# EAGLE design IR-BlueDM-MLX90620 Kit (EAGLE 6.2)
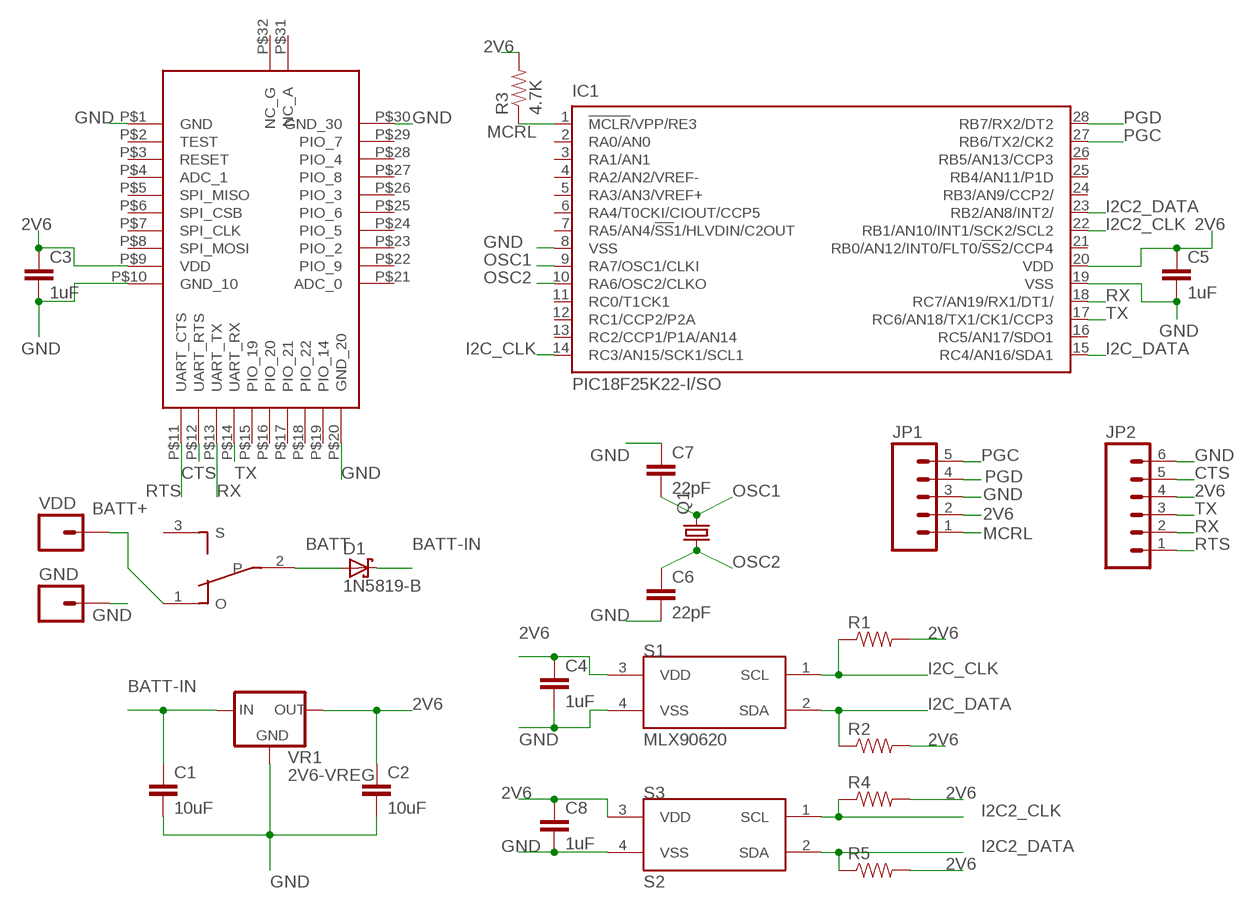
[diagram p0: schematic, sheet 1]

## Parts
C1  10uF  CAPPTH1  [CAP-PTH-5MM]
C2  10uF  CAPPTH1  [CAP-PTH-5MM]
C3  1uF  CAPPTH1  [CAP-PTH-5MM]
C4  1uF  CAPPTH1  [CAP-PTH-5MM]
C5  1uF  CAPPTH1  [CAP-PTH-5MM]
C6  22pF  CAPPTH1  [CAP-PTH-5MM]
C7  22pF  CAPPTH1  [CAP-PTH-5MM]
C8  1uF  CAPPTH1  [CAP-PTH-5MM]
D1  1N5819-B  [DO41-7.6]
GND  M01PTH  [1X01]
IC1  PIC18F25K22-I/SO  [SO28W]
IC2  BR-LE4.0-D2A  [BR-LE4.0-X2A]
JP1  M05PTH  [1X05]
JP2  M06SIP  [1X06]
Q1  CRYSTALHC49S  [HC49/S]
R1  RESISTORPTH-1/4W  [AXIAL-0.4]
R2  RESISTORPTH-1/4W  [AXIAL-0.4]
R3  4.7K  RESISTORPTH-1/4W  [AXIAL-0.4]
R4  RESISTORPTH-1/4W  [AXIAL-0.4]
R5  RESISTORPTH-1/4W  [AXIAL-0.4]
S1  MLX90620  [TO-39]
S2  SMALL_SWITCH  [EG1213]
S3  S2  MLX90620  [TO-39]
VDD  M01PTH  [1X01]
VR1  2V6-VREG  [TO-92]

## Nets
2V6: C2.1 C3.1 C4.1 C5.1 C8.1 IC1.20(VDD) IC2.P$9(VDD) JP1.2 JP2.4 R1.P$2 R2.P$2 R3.P$2 R4.P$2 R5.P$2 S1.3(VDD) S3.3(VDD) VR1.1(OUT)
BATT: D1.A S2.2(P)
BATT+: S2.1(O) VDD.1
BATT-IN: C1.1 D1.C VR1.3(IN)
CTS: IC2.P$12(UART_RTS) JP2.5
GND [Small 8mil]: C1.2 C2.2 C3.2 C4.2 C5.2 C6.2 C7.1 C8.2 GND.1 IC1.8(VSS) IC1.19(VSS) IC2.P$1(GND) IC2.P$10(GND_10) IC2.P$20(GND_20) IC2.P$30(GND_30) JP1.3 JP2.6 S1.4(VSS) S3.4(VSS) VR1.2(GND)
I2C2_CLK: IC1.22(RB1/AN10/INT1/SCK2/SCL2) R4.P$1 S3.1(SCL)
I2C2_DATA: IC1.23(RB2/AN8/INT2/) R5.P$1 S3.2(SDA)
I2C_CLK [Small 8mil]: IC1.14(RC3/AN15/SCK1/SCL1) R1.P$1 S1.1(SCL)
I2C_DATA: IC1.15(RC4/AN16/SDA1) R2.P$1 S1.2(SDA)
MCRL: IC1.1(!MCLR!/VPP/RE3) JP1.1 R3.P$1
OSC1 [Medium 10mil]: C7.2 IC1.9(RA7/OSC1/CLKI) Q1.2
OSC2 [Medium 10mil]: C6.1 IC1.10(RA6/OSC2/CLKO) Q1.1
PGC: IC1.27(RB6/TX2/CK2) JP1.5
PGD: IC1.28(RB7/RX2/DT2) JP1.4
RTS: IC2.P$11(UART_CTS) JP2.1
RX: IC1.18(RC7/AN19/RX1/DT1/) IC2.P$13(UART_TX) JP2.2
TX: IC1.17(RC6/AN18/TX1/CK1/CCP3) IC2.P$14(UART_RX) JP2.3
Unconnected: IC1.2(RA0/AN0) IC1.3(RA1/AN1) IC1.4(RA2/AN2/VREF-) IC1.5(RA3/AN3/VREF+) IC1.6(RA4/T0CKI/CIOUT/CCP5) IC1.7(RA5/AN4/!SS!1/HLVDIN/C2OUT) IC1.11(RC0/T1CK1) IC1.12(RC1/CCP2/P2A) IC1.13(RC2/CCP1/P1A/AN14) IC1.16(RC5/AN17/SDO1) IC1.21(RB0/AN12/INT0/FLT0/!SS!2/CCP4) IC1.24(RB3/AN9/CCP2/) IC1.25(RB4/AN11/P1D) IC1.26(RB5/AN13/CCP3) IC2.P$2(TEST) IC2.P$3(RESET) IC2.P$4(ADC_1) IC2.P$5(SPI_MISO) IC2.P$6(SPI_CSB) IC2.P$7(SPI_CLK) IC2.P$8(SPI_MOSI) IC2.P$15(PIO_19) IC2.P$16(PIO_20) IC2.P$17(PIO_21) IC2.P$18(PIO_22) IC2.P$19(PIO_14) IC2.P$21(ADC_0) IC2.P$22(PIO_9) IC2.P$23(PIO_2) IC2.P$24(PIO_5) IC2.P$25(PIO_6) IC2.P$26(PIO_3) IC2.P$27(PIO_8) IC2.P$28(PIO_4) IC2.P$29(PIO_7) IC2.P$31(NC_A) IC2.P$32(NC_G) S2.3(S)

## Library data of the parts
C1-C8 = SparkFun-Boards:CAP: Capacitor Standard 0603 ceramic capacitor, and 0.1" leaded capacitor.
D1 = diode:1N581*: 1.0A SCHOTTKY BARRIER RECTIFIER Source: http://www.diodes.com/datasheets/ds23001.pdf
GND VDD = SparkFun-Connectors:M01: Header 1 Standard 1-pin 0.1" header. Use with straight break away headers (SKU : PRT-00116), right angle break away headers (PRT-00553), swiss pins (PRT-00743), machine pins (PRT-00117), and female headers (PRT-00115).
IC1 = pic18f25k22:PIC18F25K22: PIC18F25K22 28 pin DIP
IC2 = BlueRadios_D2_S2_C46_Eagle_footprint:BR-LE4.0-D2A
JP1 = SparkFun-Connectors:M05: Header 5 Standard 5-pin 0.1" header. Use with straight break away headers (SKU : PRT-00116), right angle break away headers (PRT-00553), swiss pins (PRT-00743), machine pins (PRT-00117), and female headers (PRT-00115). Molex polarized connector foot print use with SKU : PRT-08230 with associated crimp pins and housings.
JP2 = SparkFun-Connectors:M06: Header 6 Standard 6-pin 0.1" header. Use with straight break away headers (SKU : PRT-00116), right angle break away headers (PRT-00553), swiss pins (PRT-00743), machine pins (PRT-00117), and female headers (PRT-00115). Molex polarized connector foot print use with SKU : PRT-08094 with associated crimp pins and housings. NOTES ON THE VARIANTS LOCK and LOCK_LONGPADS... This footprint was designed to help hold the alignment of a through-hole component (i.e. 6-pin header) while soldering it into place. You may notice that each hole has been shifted either up or down by 0.005 of an inch from it's more standard position (which is a perfectly straight line). This slight alteration caused the pins (the squares in the middle) to touch the edges of the holes. Because they are alternating, it causes a "brace" to hold the component in place. 0.005 has proven to be the perfect amount of "off-center" position when using our standard breakaway headers. Although looks a little odd when you look at the bare footprint, once you have a header in there, the alteration is very hard to notice. Also, if you push a header all the way into place, it is covered up entirely on the bottom side. This idea of altering the position of holes to aid alignment will be further integrated into the Sparkfun Library for other footprints. It can help hold any component with 3 or more connection pins.
Q1 = crystal:CRYSTAL: CRYSTAL; OC_FARNELL: 1667008; OC_NEWARK: unknown
R1-R5 = SparkFun-LED:RESISTOR: Resistor Basic schematic elements and footprints for 0603, 1206, and PTH resistors.
S1 S3 = RHWorkshop:MLX90620: The MLX90620 is a fully calibrated 16x4 pixels IR array in an industry standard 4-lead TO-39 package. It contains 2 chips in one package: the Mlx90670 (IR array with signal conditioning electronics) and the 24AA02 (256x8 EEPROM) chip. The MlX90620 contains 64 IR pixels with dedicated low noise chopper stabilized amplifier and fast ADC integrated. A PTAT (Proportional To Absolute Temperature) sensor is integrated to measure the ambient temperature of the chip. The outputs of both IR and PTAT sensors are stored in internal RAM and are accessible through I2C.
S2 = RHWorkshop:SMALL_SWITCH
VR1 = RHWorkshop:2V6-VREG

## Net classes
0 default: width 0.406 mm, drill 0.305 mm, clearance 0.305 mm
1 Small 8mil: width 0.203 mm, drill 0.254 mm, clearance 0.203 mm
2 Medium 10mil: width 0.254 mm, drill 0.254 mm, clearance 0.254 mm
3 Large 12mil: width 0.305 mm, drill 0.254 mm, clearance 0.305 mm

## Board
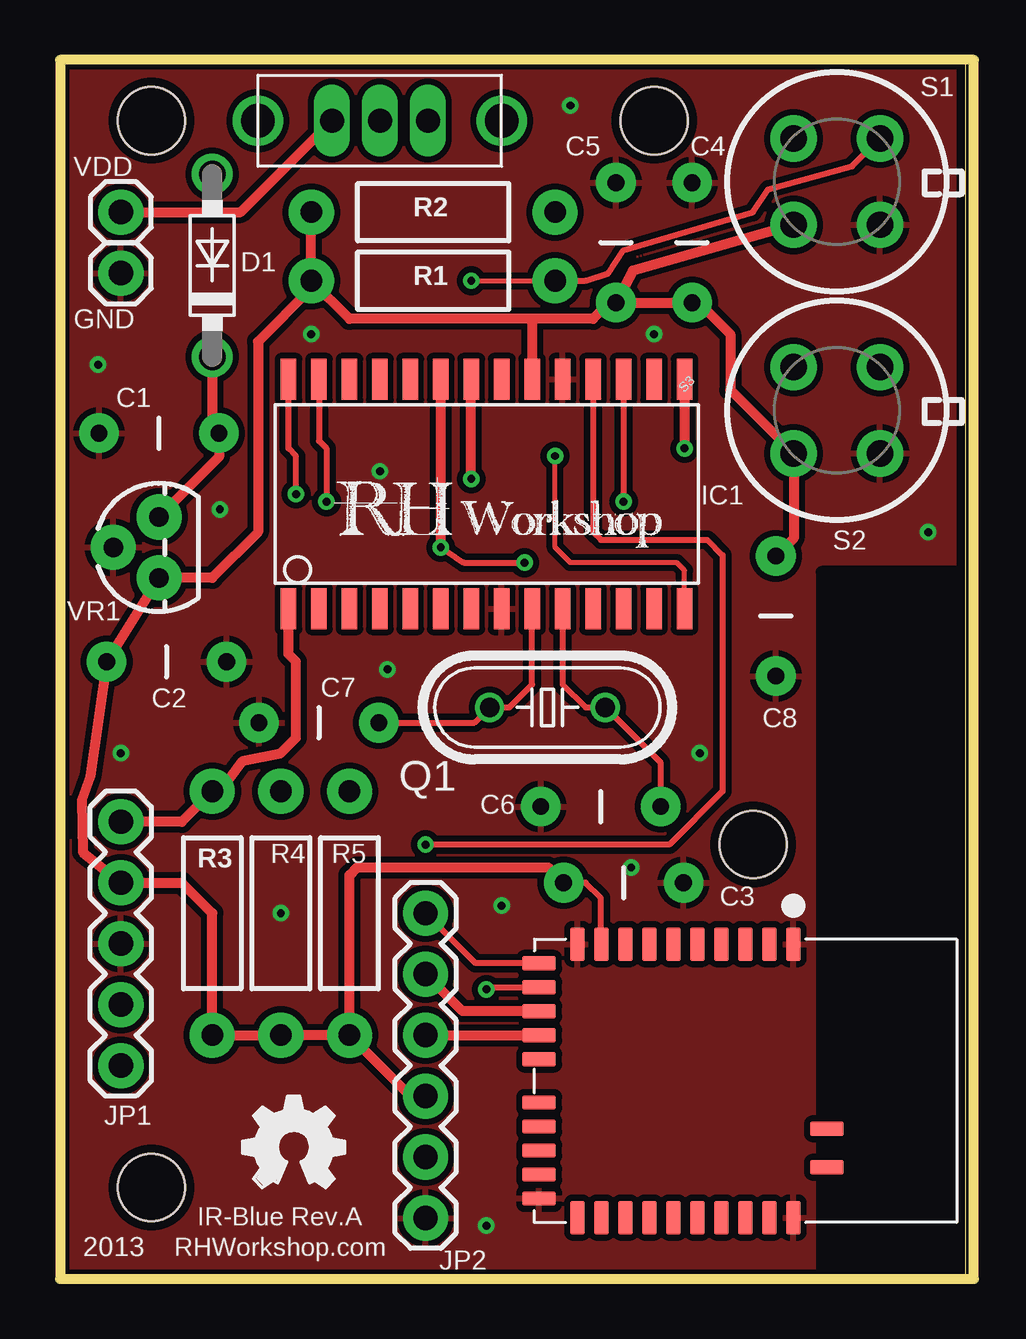
[diagram p1: board, top side]
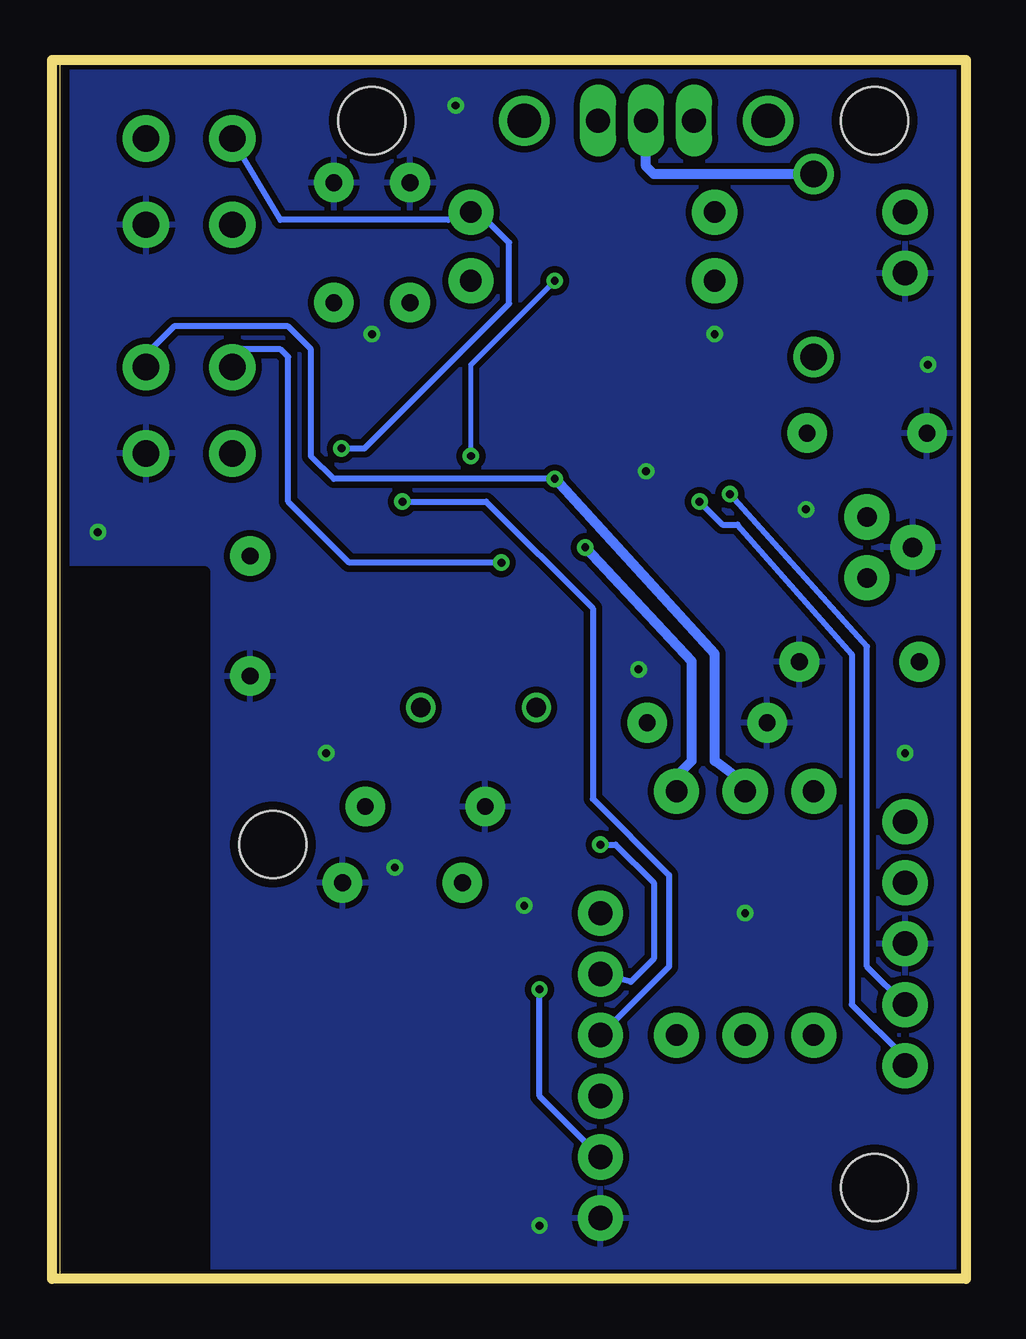
[diagram p2: board, bottom side, seen from below]

Size 37.77 x 50.79 mm. Coordinates in mm from the lower left corner, seen from the top.
Outline: 0,0 37.77,0 37.77,50.79 0,50.79 0,0
Copper layers (1*16): Top 0.0356mm / dielectric 1.5011mm / Bottom 0.0356mm
Design rules: minimum track width 6mil, minimum drill 13mil, track to track 6mil, track to pad 6mil, pad to pad 6mil, via to via 6mil, smd to smd 6mil, copper to edge 15mil, drill to drill 6mil, minimum pad ring 7mil, minimum via ring 7mil, stop-mask expansion 4mil, vias tented up to drill 15mil, thermal gap 10mil
Holes 2.8 mm at 3.81,3.81 28.89,18.1 3.81,48.26 24.77,48.26
tRestrict: area 31.7,0 to 38.1,29.5
bRestrict: area 31.7,0 to 38.1,29.5
Milling: 4 lines

### Footprints (pad centres in the part's own frame; a part is rotated, then mirrored left to right if it is on the bottom)
CAP-PTH-5MM = drill 0.7 pad 1.651: 1 -2.5,0; 2 2.5,0
DO41-7.6 = drill 1.1 pad 1.7: A 3.81,0; C -3.81,0
1X01 = drill 1.016 pad 1.88: 1 0,0
SO28W = smd 0.65 x 1.7: 1 -7.62,-4.78; 2 -6.35,-4.78; 3 -5.08,-4.78; 4 -3.81,-4.78; 5 -2.54,-4.78; 6 -1.27,-4.78; 7 0,-4.78; 8 1.27,-4.78; 9 2.54,-4.78; 10 3.81,-4.78; 11 5.08,-4.78; 12 6.35,-4.78; 13 7.62,-4.78; 14 8.89,-4.78; 15 8.89,4.78; 16 7.62,4.78; 17 6.35,4.78; 18 5.08,4.78; 19 3.81,4.78; 20 2.54,4.78; 21 1.27,4.78; 22 0,4.78; 23 -1.27,4.78; 24 -2.54,4.78; 25 -3.81,4.78; 26 -5.08,4.78; 27 -6.35,4.78; 28 -7.62,4.78
BR-LE4.0-X2A = smd 0.6 x 1.4: P$1 -2,-5.7; P$2 -1,-5.7; P$3 0,-5.7; P$4 1,-5.7; P$5 2,-5.7; P$6 3,-5.7; P$7 4,-5.7; P$8 5,-5.7; P$9 6,-5.7; P$10 7,-5.7; P$21 7,5.7; P$22 6,5.7; P$23 5,5.7; P$24 4,5.7; P$25 3,5.7; P$26 2,5.7; P$27 1,5.7; P$28 0,5.7; P$29 -1,5.7; P$30 -2,5.7 | smd 1.4 x 0.6: P$11 8.6,-4.9; P$12 8.6,-3.9; P$13 8.6,-2.9; P$14 8.6,-1.9; P$15 8.6,-0.9; P$16 8.6,0.9; P$17 8.6,1.9; P$18 8.6,2.9; P$19 8.6,3.9; P$20 8.6,4.9; P$31 -3.4,3.6; P$32 -3.4,2
1X05 = drill 1.016 pad 1.88: 1 0,0; 2 2.54,0; 3 5.08,0; 4 7.62,0; 5 10.16,0
1X06 = drill 1.016 pad 1.88: 1 0,0; 2 2.54,0; 3 5.08,0; 4 7.62,0; 5 10.16,0; 6 12.7,0
HC49/S = drill 0.813: 1 -2.413,0; 2 2.413,0
AXIAL-0.4 = drill 0.9 pad 1.88: P$1 -5.08,0; P$2 5.08,0
TO-39 = drill 1.1 pad 1.93: 1 2.54,0; 2 0,2.54; 3 -2.54,0; 4 0,-2.54
EG1213 = drill 1 long: 1 -1.999,0; 2 0,0; 3 1.999,0 | drill 1.4: P$1 -5.08,0; P$2 5.08,0
TO-92 = drill 0.813 pad 1.88: 1 -1.27,0; 2 0,1.905; 3 1.27,0

### Placement (x,y rotation side)
C1  4.13,35.24 180 top
C2  4.45,25.72 0 top
C3  23.5,16.51 0 top
C4  26.35,43.18 90 top
C5  23.18,43.18 90 top
C6  22.54,19.68 180 top
C7  10.79,23.18 0 top
C8  29.84,27.62 270 top
D1  6.35,42.23 90 top
GND  2.54,41.91 0 top
IC1  17.14,32.7 0 top
IC2  28.57,8.26 180 top
JP1  2.54,19.05 270 top
JP2  15.24,15.24 270 top
Q1  20.32,23.81 180 top
R1  15.56,41.59 180 top
R2  15.56,44.45 180 top
R3  6.35,15.24 270 top
R4  9.21,15.24 270 top
R5  12.06,15.24 270 top
S1  32.38,45.72 45 top
S2  13.34,48.26 0 top
S3  32.38,36.2 45 top
U$1  [RH-LOGO]  11.43,30.48 0 top
U$2  [OSHW_FILLX150_NOTEXT]  7.62,3.81 0 top
VDD  2.54,44.45 0 top
VR1  4.13,30.48 90 top

### Tracks (layer width: path | path; a pad name or v marks a point on that pad's centre or on a via)
2V6
  Top 0.254: IC2.P$9 22.54,13.96 22.54,15.88 21.91,16.51 C3.1
  Top 0.406: R5.P$2 R4.P$2 R3.P$2 6.35,15.24 5.08,16.51 JP1.2 0.95,17.78 0.91,19.96 1.27,20.95 C2.1 VR1.1 6.35,29.21 8.26,31.11 8.26,39.05 10.48,41.27 R1.P$2 | C8.1 30.59,30.87 S3.3 27.94,37.05 27.94,39.37 26.63,40.68 C4.1 C5.1 | S1.3 23.88,42.02 C5.1 | C5.1 22.9,40.68 22.23,40.01 19.68,40.01 | 19.68,40.01 12.06,40.01 R1.P$2 | R1.P$2 R2.P$2 | JP2.4 14.61,7.62 R5.P$2 | R5.P$2 12.06,16.83 12.38,17.14 20.36,17.14 C3.1 | 19.68,40.01 IC1.20
BATT
  Bottom 0.406: D1.A 13.02,46.04 13.34,46.35 S2.2
BATT+
  Top 0.406: VDD.1 7.53,44.45 S2.1
BATT-IN
  Top 0.406: D1.C 6.35,35.52 C1.1 6.63,34.25 VR1.3
CTS  (via drill 0.33)
  Top 0.254: v17.78,12.06 17.87,12.15 IC2.P$12
  Bottom 0.254: JP2.5 17.78,7.62 v17.78,12.06
GND  (via drill 0.33)
  other vias: 36.2,31.11 21.27,48.9 1.59,38.1 10.48,39.37 24.77,39.37 13.65,25.4 26.67,21.91 23.81,17.14 18.41,15.56 17.78,2.22 9.21,15.24 2.54,21.91 13.34,33.66 6.67,32.07
  pour Top (isolate 0.254, rank 6): 0,50.8 38.1,50.8 38.1,0 0,0
  pour Bottom (isolate 0.254, rank 6): 0,50.8 38.1,50.8 38.1,0 0,0
I2C2_CLK  (via drill 0.33)
  Top 0.406: v17.14,33.34 IC1.22
  Bottom 0.254: v17.14,33.34 26.35,33.34 27.3,34.29 27.3,38.73 28.26,39.69 33.02,39.69 34.18,38.53 S3.1
  Bottom 0.406: R4.P$1 9.21,20.64 10.48,21.59 10.48,26.04 v17.14,33.34
I2C2_DATA  (via drill 0.33)
  Top 0.254: v15.88,30.48 16.83,29.84 v19.37,29.84
  Top 0.406: v15.88,30.48 IC1.23
  Bottom 0.254: v19.37,29.84 25.72,29.84 28.26,32.38 28.26,38.42 28.57,38.73 30.16,38.73 30.59,38.21 S3.2
  Bottom 0.406: R5.P$1 12.06,20.95 11.43,21.59 11.43,25.72 v15.88,30.48
I2C_CLK  (via drill 0.33)
  Top 0.203: IC1.14 26.04,29.53 25.72,29.84 21.27,29.84 20.64,30.48 v20.64,34.29 | v17.14,41.59 R1.P$1
  Top 0.254: R1.P$1 21.91,41.59 22.86,41.91 23.5,42.86 28.89,44.45 29.53,45.4 33.02,46.35 S1.1
  Bottom 0.203: v20.64,34.29 20.64,38.1 v17.14,41.59
I2C_DATA  (via drill 0.33)
  Top 0.406: IC1.15 v26.04,34.61
  Bottom 0.254: v26.04,34.61 25.08,34.61 19.05,40.64 19.05,43.18 20.32,44.45 R2.P$1 21.59,44.13 28.57,44.13 S1.2
MCRL
  Top 0.406: IC1.1 9.53,26.04 9.84,25.72 9.84,22.54 9.21,21.91 7.62,21.59 6.67,20.32 R3.P$1 5.08,19.05 JP1.1
OSC1
  Top 0.254: C7.2 17.27,23.18 Q1.2 18.73,23.81 19.68,24.77 IC1.9
OSC2
  Top 0.254: C6.1 25.04,21.5 Q1.1 21.91,23.81 20.95,24.77 IC1.10
PGC  (via drill 0.33)
  Top 0.254: IC1.27 10.79,34.92 11.11,34.61 v11.11,32.38
  Bottom 0.254: v11.11,32.38 10.16,31.43 9.53,31.43 4.76,26.04 4.76,11.43 2.54,9.21 JP1.5
PGD  (via drill 0.33)
  Top 0.254: v9.84,32.7 9.84,34.29 9.53,34.61 IC1.28
  Bottom 0.254: JP1.4 4.13,13.02 4.13,26.35 v9.84,32.7
RTS
  Top 0.254: IC2.P$11 17.32,13.15 JP2.1
RX  (via drill 0.33)
  Top 0.254: IC1.18 22.23,31.11 22.54,30.8 26.99,30.8 27.62,30.16 27.62,20.32 25.4,18.1 v15.24,18.1
  Top 0.406: IC2.P$13 16.79,11.15 JP2.2
  Bottom 0.254: v15.24,18.1 14.61,18.1 13.02,16.51 13.02,13.34 13.97,12.38 JP2.2
TX  (via drill 0.33)
  Top 0.254: IC1.17 v23.5,32.38
  Top 0.406: JP2.3 IC2.P$14
  Bottom 0.254: v23.5,32.38 20,32.38 15.56,27.94 15.56,20 12.38,16.83 12.38,13.02 JP2.3

### Text on the board
_tsilk: IR-Blue Rev.A | 2013 | RHWorkshop.com